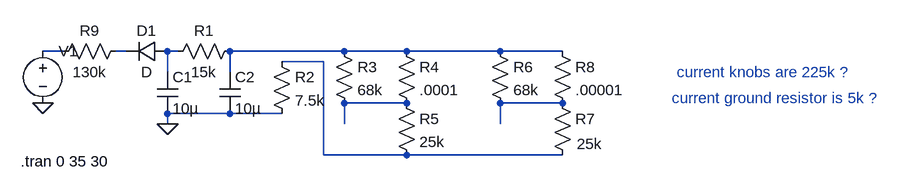
[diagram p0: schematic bias_circuit.asc]
bias_circuit.asc, the LTspice schematic file:
Version 4
SHEET 1 1348 680
WIRE 16 144 -16 144
WIRE 112 144 96 144
WIRE 192 144 176 144
WIRE 448 144 272 144
WIRE 544 144 448 144
WIRE 688 144 544 144
WIRE 784 144 688 144
WIRE 416 160 352 160
WIRE 176 176 176 144
WIRE 272 176 272 144
WIRE 544 224 448 224
WIRE 784 224 688 224
WIRE 272 240 176 240
WIRE 352 240 272 240
WIRE 176 256 176 240
WIRE 448 256 448 224
WIRE 688 256 688 224
WIRE 416 304 416 160
WIRE 544 304 416 304
WIRE 784 304 544 304
FLAG 176 256 0
FLAG -16 224 0
SYMBOL diode 176 128 R90
WINDOW 0 0 32 VBottom 2
WINDOW 3 32 32 VTop 2
SYMATTR InstName D1
SYMBOL res 288 128 R90
WINDOW 0 0 56 VBottom 2
WINDOW 3 32 56 VTop 2
SYMATTR InstName R1
SYMATTR Value 15k
SYMBOL cap 160 176 R0
SYMATTR InstName C1
SYMATTR Value 10µ
SYMBOL cap 256 176 R0
SYMATTR InstName C2
SYMATTR Value 10µ
SYMBOL res 336 144 R0
SYMATTR InstName R2
SYMATTR Value 7.5k
SYMBOL res 432 128 R0
SYMATTR InstName R3
SYMATTR Value 68k
SYMBOL res 528 128 R0
SYMATTR InstName R4
SYMATTR Value .0001
SYMBOL res 528 208 R0
SYMATTR InstName R5
SYMATTR Value 25k
SYMBOL res 672 128 R0
SYMATTR InstName R6
SYMATTR Value 68k
SYMBOL res 768 208 R0
WINDOW 3 38 79 Left 2
SYMATTR InstName R7
SYMATTR Value 25k
SYMBOL res 768 128 R0
SYMATTR InstName R8
SYMATTR Value .00001
SYMBOL res 112 128 R90
WINDOW 0 0 56 VBottom 2
WINDOW 3 32 56 VTop 2
SYMATTR InstName R9
SYMATTR Value 130k
SYMBOL voltage -16 128 R0
WINDOW 3 24 96 Invisible 2
WINDOW 123 0 0 Left 2
WINDOW 39 0 0 Left 2
SYMATTR InstName V1
SYMATTR Value SINE(0 450 60)
TEXT -50 314 Left 2 !.tran 0 35 30
TEXT 960 176 Left 2 ;current knobs are 225k ?
TEXT 952 216 Left 2 ;current ground resistor is 5k ?

The netlist it stands for:
* bias_circuit.asc
D1 N003 N002 D
R1 N004 N003 15k
C1 N003 0 10µ
C2 N004 0 10µ
R2 N005 0 7.5k
R3 N004 N006 68k
R4 N004 N006 .0001
R5 N006 N005 25k
R6 N004 N007 68k
R7 N007 N005 25k
R8 N004 N007 .00001
R9 N002 N001 130k
V1 N001 0 SINE(0 450 60)
.model D D
.lib standard.dio
.tran 0 35 30
* current knobs are 225k ?
* current ground resistor is 5k ?
.backanno
.end